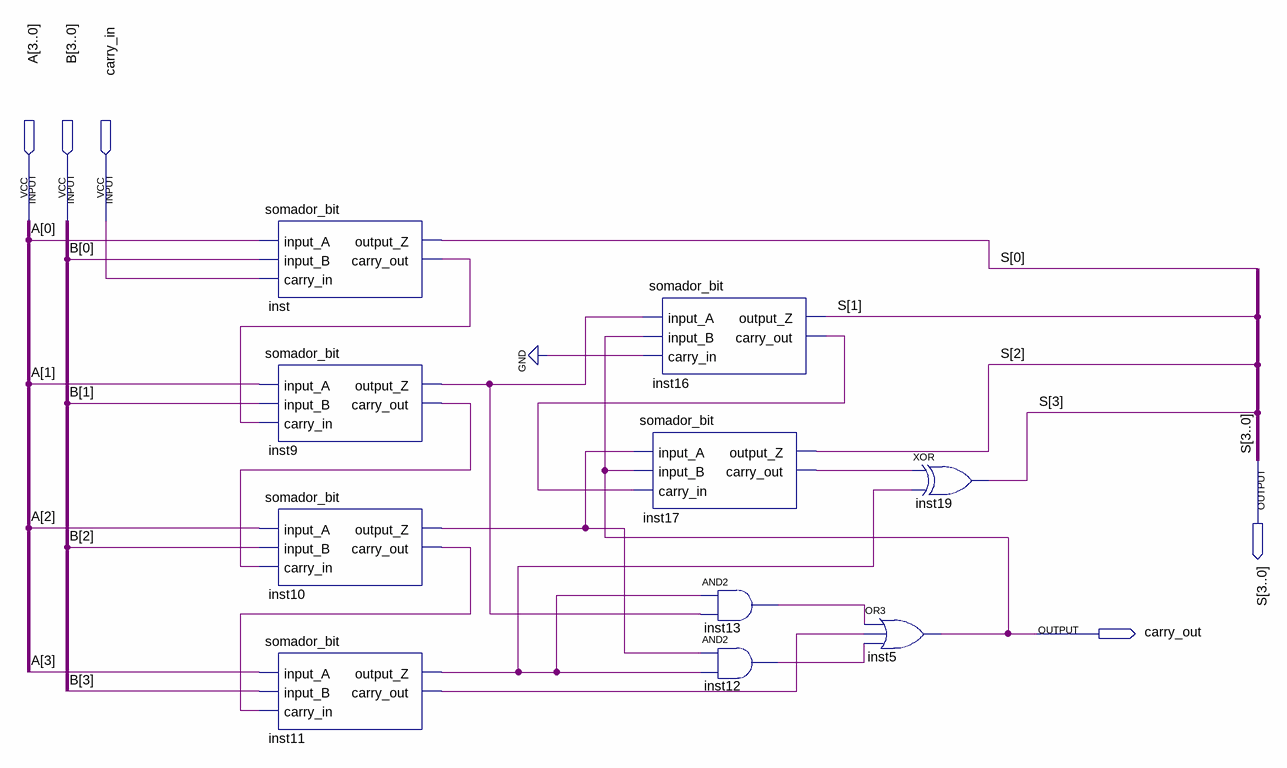
[diagram p0: schematic sheet]
// Quartus schematic BCD.bdf as structural Verilog: 10 symbols, 5 pins
module BCD (
  input  [3:0] A,
  input  [3:0] B,
  input  carry_in,
  output [3:0] S,
  output carry_out
);

  wire inst9_carry_out, inst9_output_z, inst10_carry_out, inst10_output_z, inst11_carry_out, inst11_output_z,
       inst12_out, inst13_out, inst16_carry_out, inst17_carry_out, inst_carry_out;

  somador_bit inst (.input_A(A[0]), .input_B(B[0]), .carry_in(carry_in), .output_Z(S[0]), .carry_out(inst_carry_out));
  somador_bit inst9 (
    .input_A(A[1]), .input_B(B[1]), .carry_in(inst_carry_out), .output_Z(inst9_output_z),
    .carry_out(inst9_carry_out));
  somador_bit inst10 (
    .input_A(A[2]), .input_B(B[2]), .carry_in(inst9_carry_out), .output_Z(inst10_output_z),
    .carry_out(inst10_carry_out));
  somador_bit inst11 (
    .input_A(A[3]), .input_B(B[3]), .carry_in(inst10_carry_out), .output_Z(inst11_output_z),
    .carry_out(inst11_carry_out));
  somador_bit inst17 (
    .input_A(inst10_output_z), .input_B(carry_out), .carry_in(inst16_carry_out), .output_Z(S[2]),
    .carry_out(inst17_carry_out));
  somador_bit inst16 (
    .input_A(inst9_output_z), .input_B(carry_out), .carry_in(1'b0), .output_Z(S[1]),
    .carry_out(inst16_carry_out));
  and inst13 (inst13_out, inst11_output_z, inst9_output_z);
  and inst12 (inst12_out, inst10_output_z, inst11_output_z);
  or inst5 (carry_out, inst13_out, inst11_carry_out, inst12_out);
  xor inst19 (S[3], inst17_carry_out, inst11_output_z);
endmodule
